# Altium project democritus-robot.PrjPcb
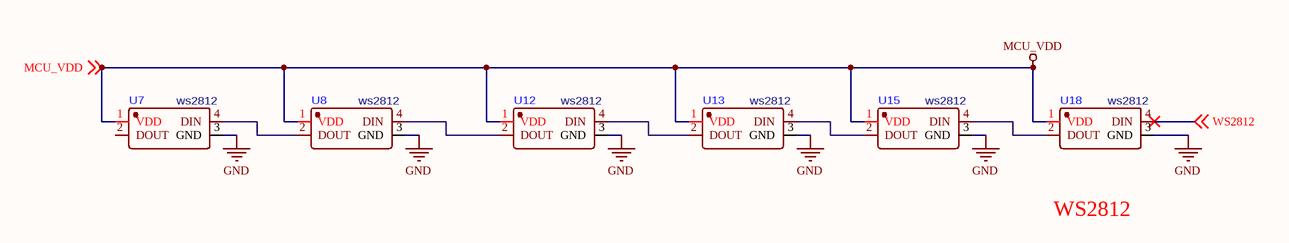
[diagram p0: 06_WS2812.SchDoc]
6 sheets, 177 parts. Net scope: global (net labels, ports and power ports of the same name join across sheets).
Board file: V1.PcbDoc
Sheets:
  06_WS2812.SchDoc
  05_interface.SchDoc
  04_Codec.SchDoc
  03_ADC.SchDoc
  02_Module.SchDoc
  01_Power.SchDoc

## Sheet 06_WS2812.SchDoc
size A4

### Parts
U7  ws2812  [WS2812B(3528)]
U8  ws2812  [WS2812B(3528)]
U12  ws2812  [WS2812B(3528)]
U13  ws2812  [WS2812B(3528)]
U15  ws2812  [WS2812B(3528)]
U18  ws2812  [WS2812B(3528)]

### Nets
GND: U7.3(GND) U8.3(GND) U12.3(GND) U13.3(GND) U15.3(GND) U18.3(GND)
MCU_VDD: U7.1(VDD) U8.1(VDD) U12.1(VDD) U13.1(VDD) U15.1(VDD) U18.1(VDD) ; off-sheet MCU_VDD
WS2812: U18.4(DIN) ; off-sheet WS2812  [project net GPIO38]
NetU7_4: U7.4(DIN) U8.2(DOUT)
NetU8_4: U8.4(DIN) U12.2(DOUT)
NetU12_4: U12.4(DIN) U13.2(DOUT)
NetU13_4: U13.4(DIN) U15.2(DOUT)
NetU15_4: U15.4(DIN) U18.2(DOUT)

Not connected (* = marked no-connect by the designer): U7 2(DOUT)

### Notes on the sheet
- WS2812

### Library data of the parts
U7 U8 U12 U13 U15 U18 = YOTC-WS2812B-3528: ws2812_3528

## Sheet 05_interface.SchDoc
size 513 x 386 mm
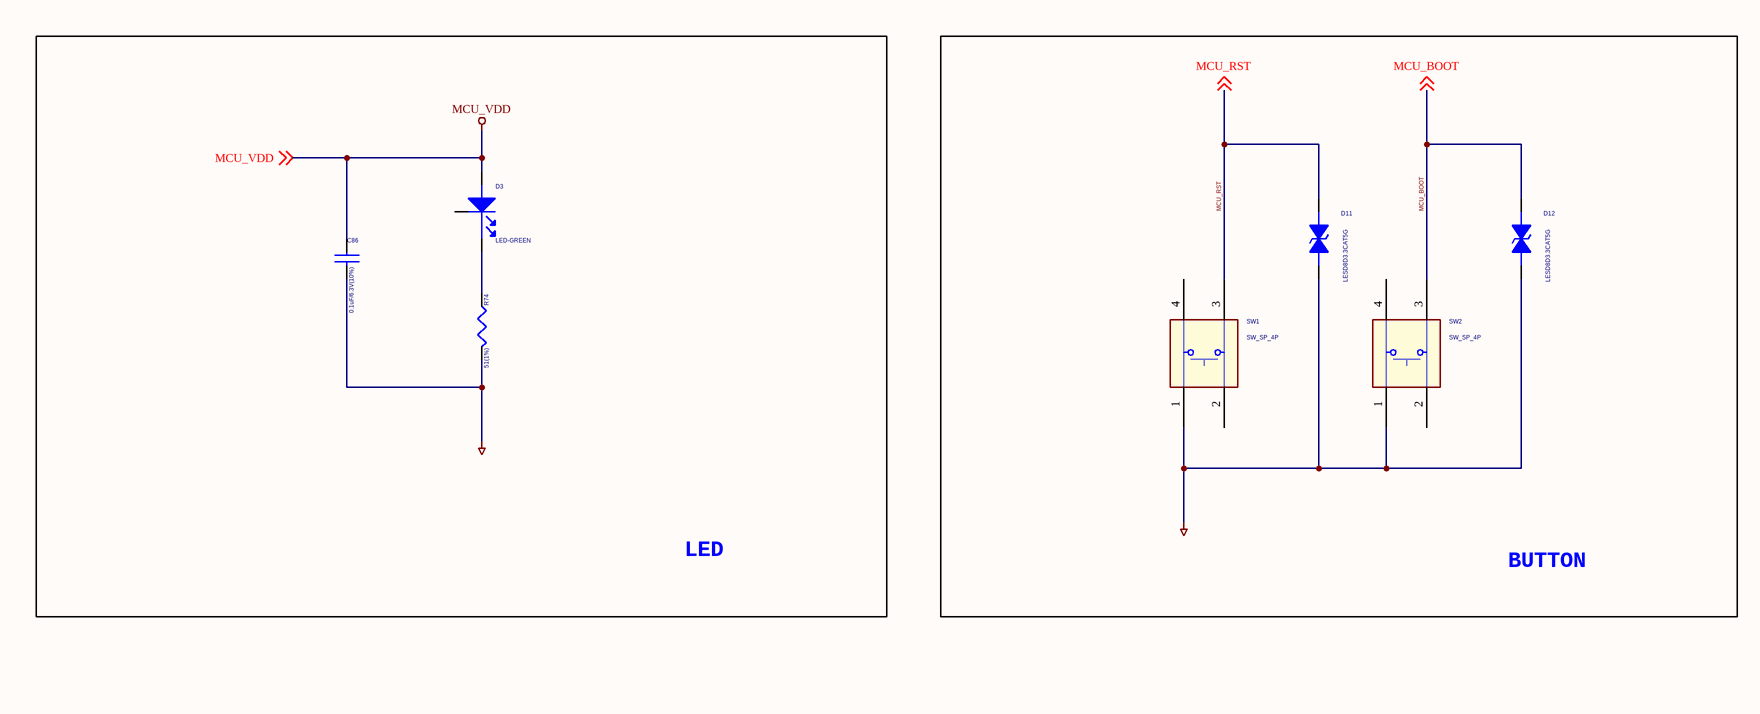
[diagram p1: 05_interface.SchDoc, left]
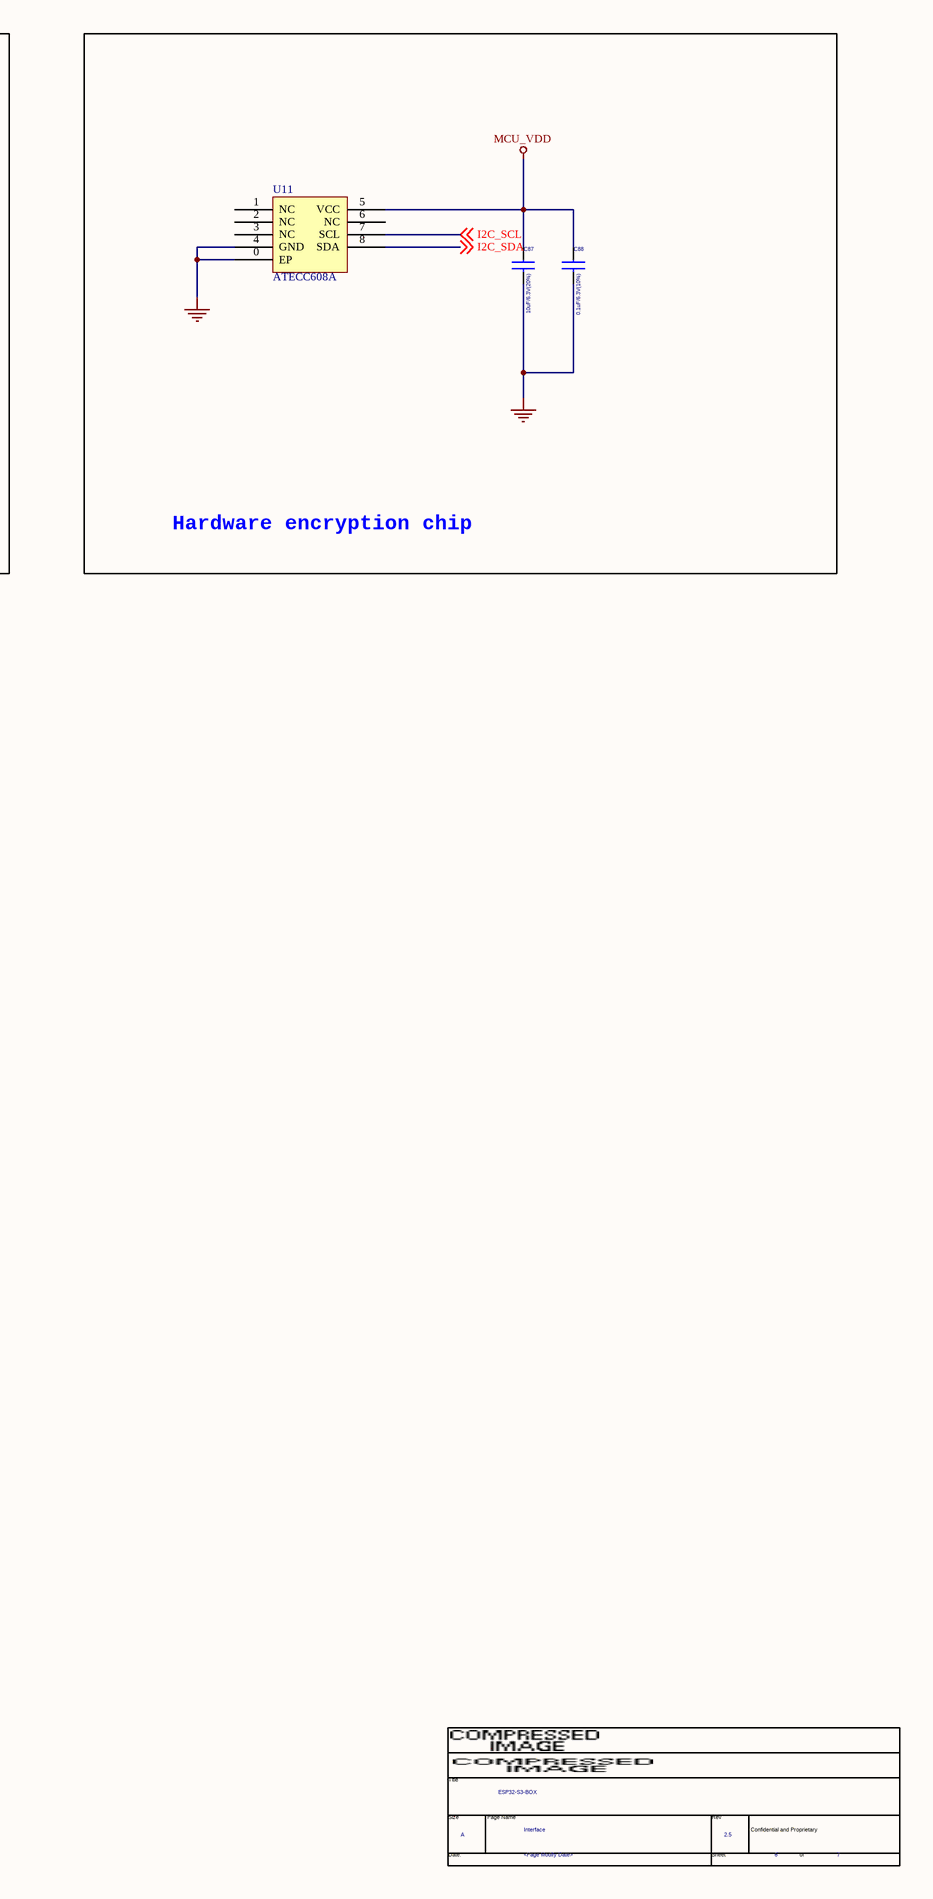
[diagram p2: 05_interface.SchDoc, right]

### Parts
(Parts that share a designator on the sheet are numbered #1, #2 ... from top to bottom, then left to right.)
*#1  Page Modify Date: <Page Modify Date>  Page Name: Interface  Title: ESP32-S3-BOX  Page Size: A  Page Number: 6  Page Count: 7  RevCode: 2.5  (hidden comment: espTitleBlock3)  (graphical)
C86  0.1uF/6.3V(10%)  [0402_C]
C87  10uF/6.3V(20%)  [0402_C]
C88  0.1uF/6.3V(10%)  [0402_C]
D3  LED-GREEN  [0603_L]
D11  LESD8D3.3CAT5G  [SOD-882]
D12  LESD8D3.3CAT5G  [SOD-882]
R74  51(1%)  [0201_R]
SW1  SW_SP_4P  [Key3*4*2.5]
SW2  SW_SP_4P  [Key3*4*2.5]
U11  ATECC608A  [DFN-8_EP_3x3mm]

### Blocks framed on the sheet
LED: C86 D3 R74
BUTTON: D11 D12 SW1 SW2
Hardware encryption chip: C87 C88 U11

### Nets
GND: C86.2 C87.2 C88.2 D11.1 D12.1 R74.2 SW1.1 SW2.1 U11.0(EP) U11.4(GND)
MCU_VDD: C86.1 C87.1 C88.1 D3.1 U11.5(VCC) ; off-sheet MCU_VDD
I2C_SCL: U11.7(SCL) ; off-sheet I2C_SCL  [project net GPIO18]
I2C_SDA: U11.8(SDA) ; off-sheet I2C_SDA  [project net GPIO8]
MCU_BOOT: D12.2 SW2.3 ; off-sheet MCU_BOOT  [project net GPIO0]
MCU_RST: D11.2 SW1.3 ; off-sheet MCU_RST
NetD3_2: D3.2 R74.1

Not connected (* = marked no-connect by the designer): D3 3; SW1 2 4; SW2 2 4; U11 1(NC) 2(NC) 3(NC) 6(NC)

### Notes on the sheet
- (in symbol espTitleBlock3) Title; Size; Page Name; Rev; Confidential and Proprietary; Date:; Sheet; of

### Library data of the parts
*#1 = espTitleBlock3: Doc: ESP32-S3-EYE_V1.0; OrgName: ESPRESSIF
C86 C88 = CAPACITOR: Part Number: ES11045102620001; CODE12: ES11.04.510.2.6.2.00; Part Type: Capacitor
C87 = CAPACITOR: Part Number: ES11047102710000; CODE12: ES11.04.710.2.7.1.00; Part Type: Capacitor
D11 D12 = DIODE_BI_DIR: Part Number: ES31320010000000; CODE12: ES31.32.0010.00.0.0; Part Type: Diode
R74 = RESISTOR: Part Number: ES21021510000001; CODE12: ES21.02.1510.0.00.0; Part Type: Resistor
SW1 SW2 = SW_SP_4P: CLASS: DISCRETE; TIME: 2004-11-29

## Sheet 04_Codec.SchDoc
size 513 x 386 mm
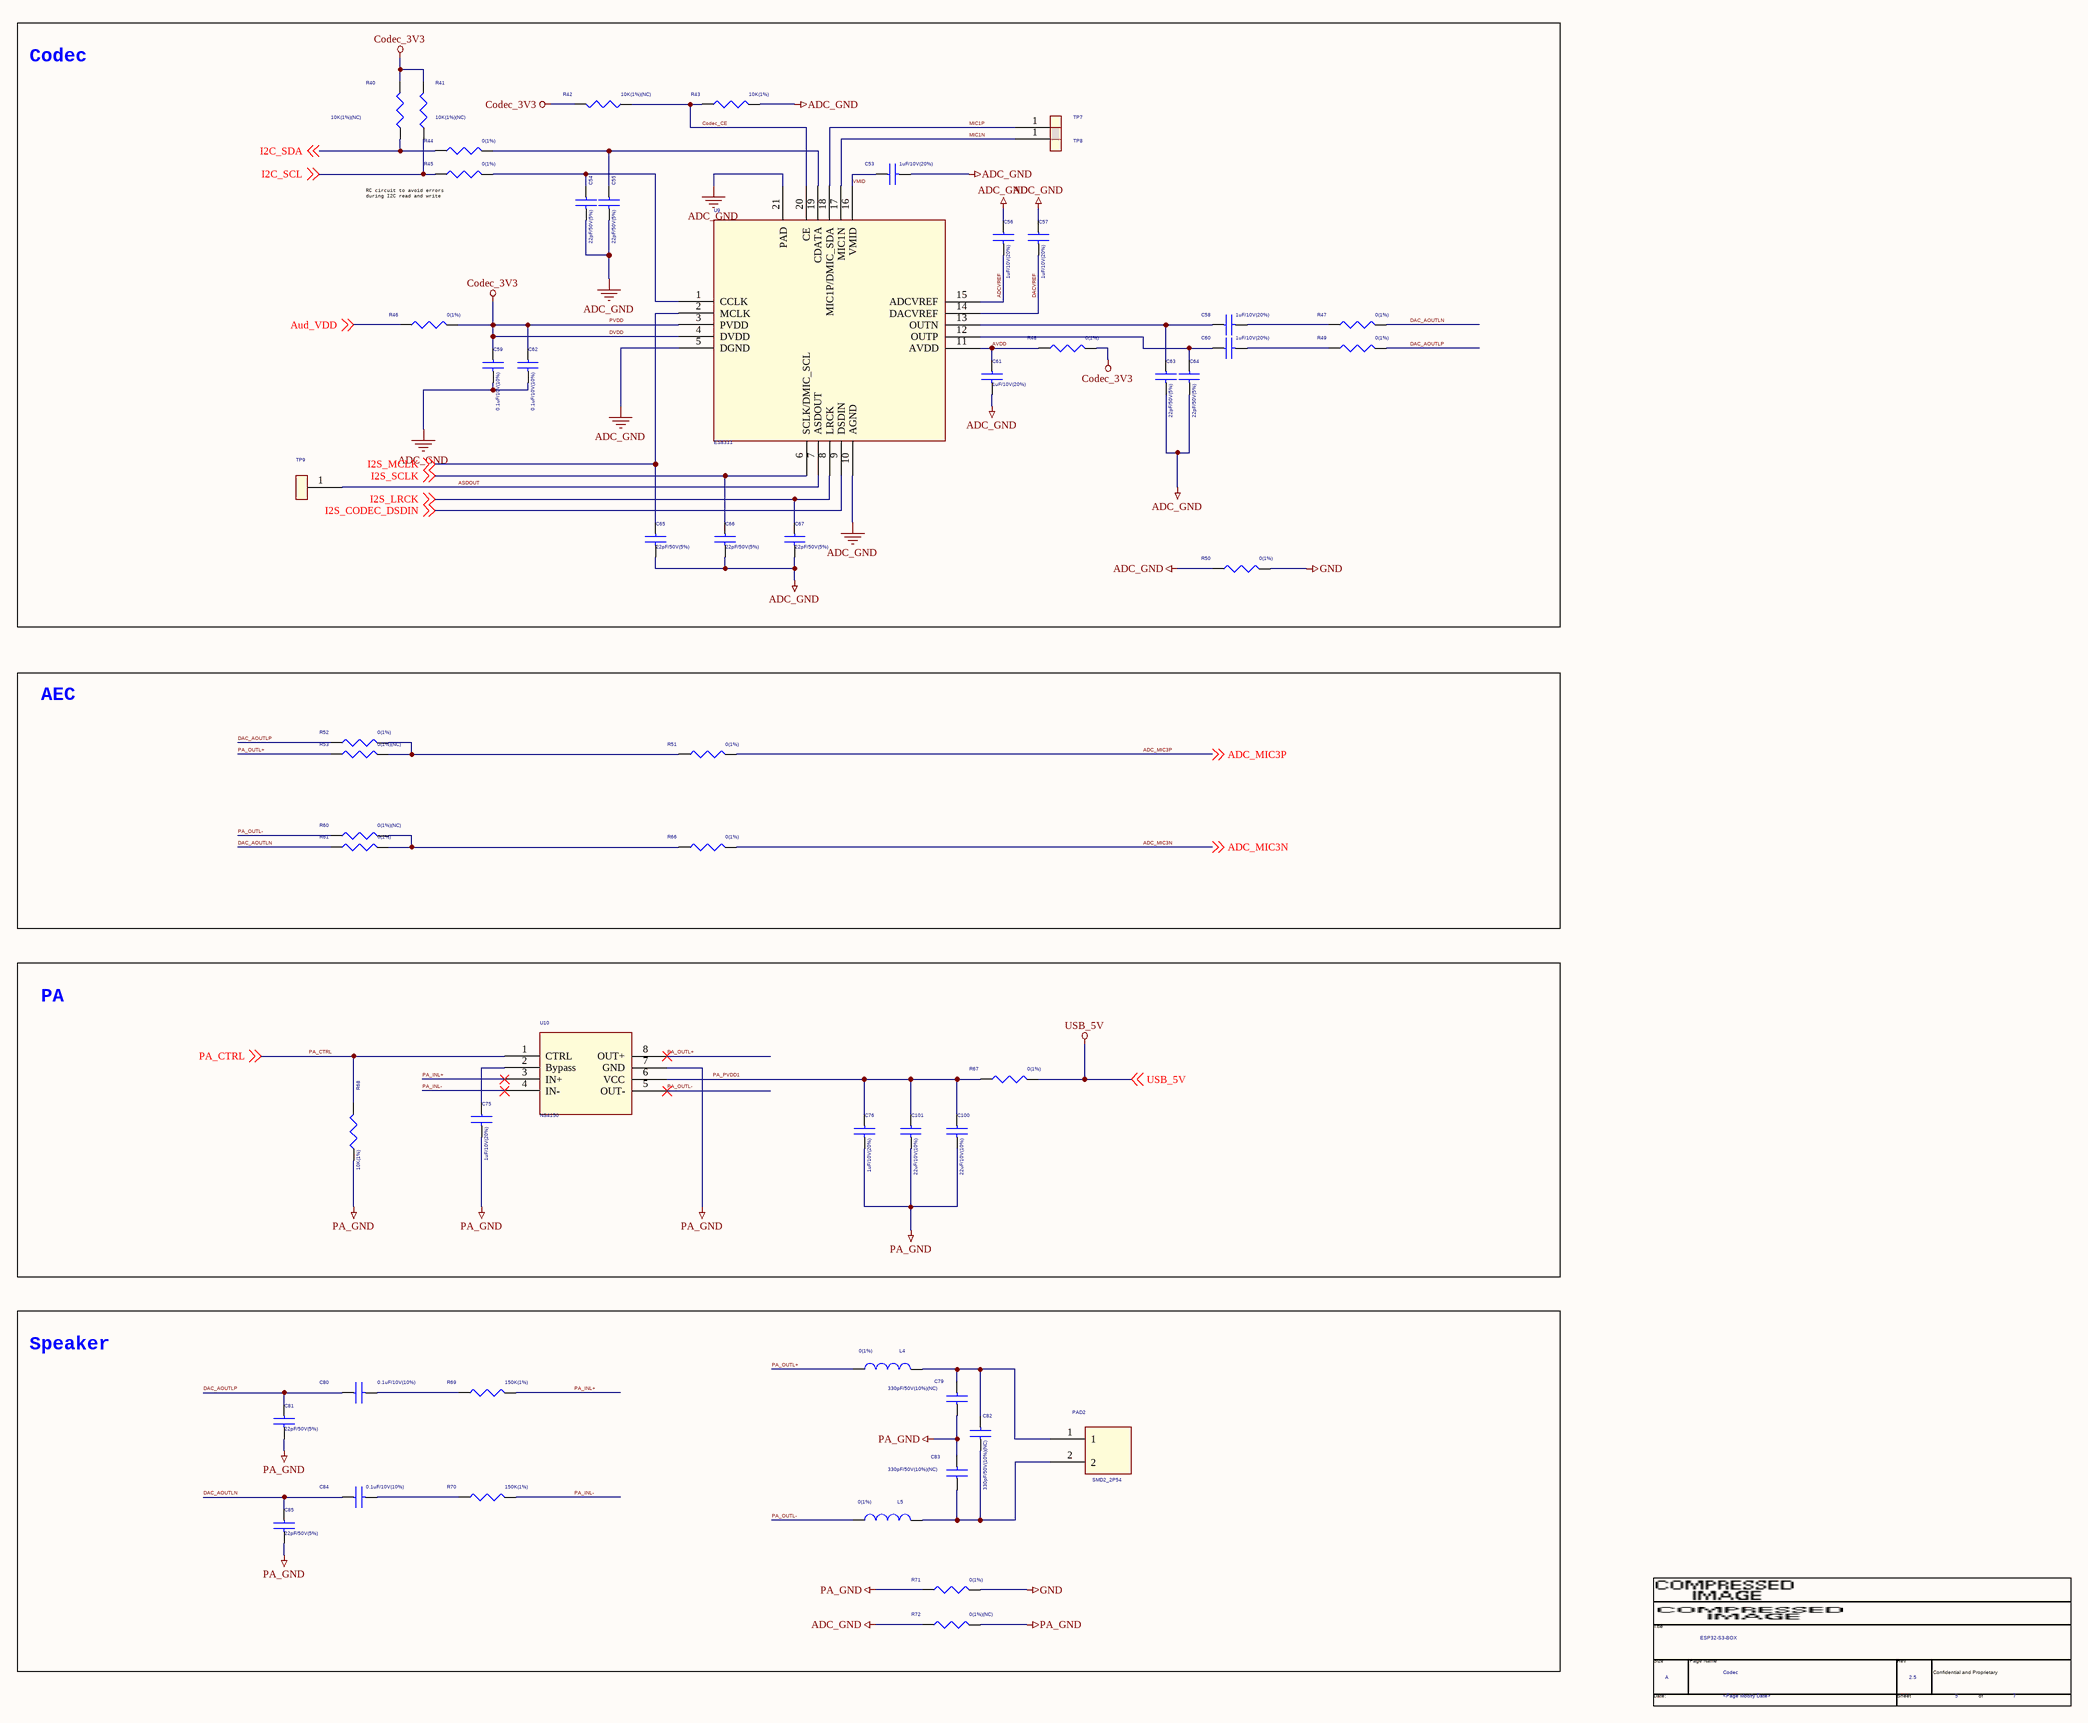
[diagram p3: 04_Codec.SchDoc]

### Parts
(Parts that share a designator on the sheet are numbered #1, #2 ... from top to bottom, then left to right.)
*#2  Page Modify Date: <Page Modify Date>  Page Name: Codec  Title: ESP32-S3-BOX  Page Size: A  Page Number: 5  Page Count: 7  RevCode: 2.5  (hidden comment: espTitleBlock3)  (graphical)
C53  1uF/10V(20%)  [0201_C]
C54  22pF/50V(5%)  [0201_C]
C55  22pF/50V(5%)  [0201_C]
C56  1uF/10V(20%)  [0201_C]
C57  1uF/10V(20%)  [0201_C]
C58  1uF/10V(20%)  [0201_C]
C59  0.1uF/10V(10%)  [0201_C]
C60  1uF/10V(20%)  [0201_C]
C61  1uF/10V(20%)  [0201_C]
C62  0.1uF/10V(10%)  [0201_C]
C63  22pF/50V(5%)  [0201_C]
C64  22pF/50V(5%)  [0201_C]
C65  22pF/50V(5%)  [0201_C]
C66  22pF/50V(5%)  [0201_C]
C67  22pF/50V(5%)  [0201_C]
C75  1uF/10V(20%)  [0201_C]
C76  1uF/10V(20%)  [0201_C]
C79  330pF/50V(10%)(NC)  [0201_C]
C80  0.1uF/10V(10%)  [0201_C]
C81  22pF/50V(5%)  [0201_C]
C82  330pF/50V(10%)(NC)  [0201_C]
C83  330pF/50V(10%)(NC)  [0201_C]
C84  0.1uF/10V(10%)  [0201_C]
C85  22pF/50V(5%)  [0201_C]
C100  22uF/10V(10%)  [0805_C]
C101  22uF/10V(10%)  [0805_C]
L4  0(1%)  [0603_R]
L5  0(1%)  [0603_R]
PAD2  SMD2_2P54  [2pin]
R40  10K(1%)(NC)  [0201_R]
R41  10K(1%)(NC)  [0201_R]
R42  10K(1%)(NC)  [0201_R]
R43  10K(1%)  [0201_R]
R44  0(1%)  [0201_R]
R45  0(1%)  [0201_R]
R46  0(1%)  [0402_R]
R47  0(1%)  [0201_R]
R48  0(1%)  [0402_R]
R49  0(1%)  [0201_R]
R50  0(1%)  [0402_R]
R51  0(1%)  [0201_R]
R52  0(1%)  [0201_R]
R53  0(1%)(NC)  [0201_R]
R60  0(1%)(NC)  [0201_R]
R61  0(1%)  [0201_R]
R66  0(1%)  [0201_R]
R67  0(1%)  [0402_R]
R68  10K(1%)  [0201_R]
R69  150K(1%)  [0402_R]
R70  150K(1%)  [0402_R]
R71  0(1%)  [0402_R]
R72  0(1%)(NC)  [0402_R]
TP7  TESTPOINT  [TPC_D40]  (value not drawn)
TP8  TESTPOINT  [TPC_D40]  (value not drawn)
TP9  TESTPOINT  [TPC_D40]  (value not drawn)
U9  ES8311  [QFN-20_4X4]
U10  NS4150  [MSOP-8]

### Blocks framed on the sheet
Codec: C53-C67 R40-R50 TP7-TP9 U9
AEC: R51-R53 R60 R61 R66
PA: C75 C76 C100 C101 R67 R68 U10
Speaker: C79-C85 L4 L5 PAD2 R69-R72

### Nets
ADC_GND: C53.2 C54.2 C55.2 C56.1 C57.1 C59.2 C61.2 C62.2 C63.2 C64.2 C65.2 C66.2 C67.2 R43.2 R50.1 R72.1 U9.5(DGND) U9.10(AGND) U9.21(PAD)
Aud_VDD: R46.1 ; off-sheet Aud_VDD
DVDD: C59.1 C62.1 R40.2 R41.2 R42.2 R46.2 R48.2 U9.3(PVDD) U9.4(DVDD)  [also labelled Codec_3V3, PVDD]
GND: R50.2 R71.2
PA_GND: C75.2 C76.2 C79.1 C81.2 C83.2 C85.2 C100.2 C101.2 R68.1 R71.1 R72.2 U10.7(GND)
USB_5V: R67.2 ; off-sheet USB_5V
ADC_MIC3N: R66.2 ; off-sheet ADC_MIC3N
ADC_MIC3P: R51.2 ; off-sheet ADC_MIC3P
ADCVREF: C56.2 U9.15(ADCVREF)
ASDOUT: TP9.1 U9.7(ASDOUT)
AVDD: C61.1 R48.1 U9.11(AVDD)
Codec_CE: R42.1 R43.1 U9.20(CE)
DAC_AOUTLN: C84.1 C85.1 R47.2 R61.1
DAC_AOUTLP: C80.1 C81.1 R49.2 R52.1
DACVREF: C57.2 U9.14(DACVREF)
I2C_SCL: R41.1 R45.1 ; off-sheet I2C_SCL  [project net GPIO18]
I2C_SDA: R40.1 R44.1 ; off-sheet I2C_SDA  [project net GPIO8]
I2S_CODEC_DSDIN: U9.9(DSDIN) ; off-sheet I2S_CODEC_DSDIN  [project net GPIO15]
I2S_LRCK: C67.1 U9.8(LRCK) ; off-sheet I2S_LRCK  [project net GPIO47]
I2S_MCLK: C65.1 U9.2(MCLK) ; off-sheet I2S_MCLK  [project net GPIO2]
I2S_SCLK: C66.1 U9.6(SCLK/DMIC_SCL) ; off-sheet I2S_SCLK  [project net GPIO17]
MIC1N: TP8.1 U9.17(MIC1N)
MIC1P: TP7.1 U9.18(MIC1P/DMIC_SDA)
PA_CTRL: R68.2 U10.1(CTRL) ; off-sheet PA_CTRL  [project net GPIO46]
PA_INL+: R69.2 U10.3(IN+)
PA_INL-: R70.2 U10.4(IN-)
PA_OUTL+: L4.2 R53.1 U10.8(OUT+)
PA_OUTL-: L5.2 R60.1 U10.5(OUT-)
PA_PVDD1: C76.1 C100.1 C101.1 R67.1 U10.6(VCC)
VMID: C53.1 U9.16(VMID)
NetC54_1: C54.1 R45.2 U9.1(CCLK)
NetC55_1: C55.1 R44.2 U9.19(CDATA)
NetC58_1: C58.1 C63.1 U9.13(OUTN)
NetC58_2: C58.2 R47.1
NetC60_1: C60.1 C64.1 U9.12(OUTP)
NetC60_2: C60.2 R49.1
NetC75_1: C75.1 U10.2(Bypass)
NetC79_2: C79.2 C82.2 L4.1 PAD2.1
NetC80_2: C80.2 R69.1
NetC82_1: C82.1 C83.1 L5.1 PAD2.2
NetC84_2: C84.2 R70.1
NetR51_1: R51.1 R52.2 R53.2
NetR60_2: R60.2 R61.2 R66.1

### Notes on the sheet
- (near R45) RC circuit to avoid errors
  during I2C read and write
- (in symbol espTitleBlock3) Title; Size; Page Name; Rev; Confidential and Proprietary; Date:; Sheet; of

### Library data of the parts
*#2 = espTitleBlock3: as *#1 on sheet 05_interface
C53 C56-C58 C60 C61 C75 C76 = CAPACITOR: Part Number: ES11026103700001; CODE12: ES11.02.610.3.7.0.00; Part Type: Capacitor
C54 C55 C63-C67 C81 C85 = CAPACITOR: Part Number: ES11021226520000; CODE12: ES11.02.122.6.5.2.00; Part Type: Capacitor
C59 C62 C80 C84 = CAPACITOR: Part Number: ES11025103610001; CODE12: ES11.02.510.3.6.1.00; Part Type: Capacitor
C79 C82 C83 = CAP NP
C100 C101 = CAPACITOR: Part Number: ES11087223720000; CODE12: ES11.08.722.3.7.2.00; Part Type: Capacitor
L4 L5 = INDUCTOR
R40-R43 R68 = RESISTOR: Part Number: ES21024100000001; CODE12: ES21.02.4100.0.00.0; Part Type: Resistor
R44 R45 R47 R49 R51-R53 R60 R61 R66 = RESISTOR: Part Number: ES21020000000001; CODE12: ES21.02.0000.0.00.0; Part Type: Resistor
R46 R48 R50 R67 R71 R72 = RESISTOR: Part Number: ES21040000000001; CODE12: ES21.04.0000.0.00.0; Part Type: Resistor
R69 R70 = RESISTOR: Part Number: ES21045150000001; CODE12: ES21.04.5150.0.00.0; Part Type: Resistor
TP7-TP9 = TESTPOINT: Part Number: ES51990010000000; CODE12: ES51.99.0010.00.00; Part Type: -
U9 = ES8311: Part Number: ES41181204000000; CODE12: ES41.18.12.04.00.00; Part Type: Audio ICs
U10 = NS4150: Part Number: ES41180401000000; CODE12: ES41.18.04.01.00.00; Part Type: Audio ICs

## Sheet 03_ADC.SchDoc
size 513 x 386 mm
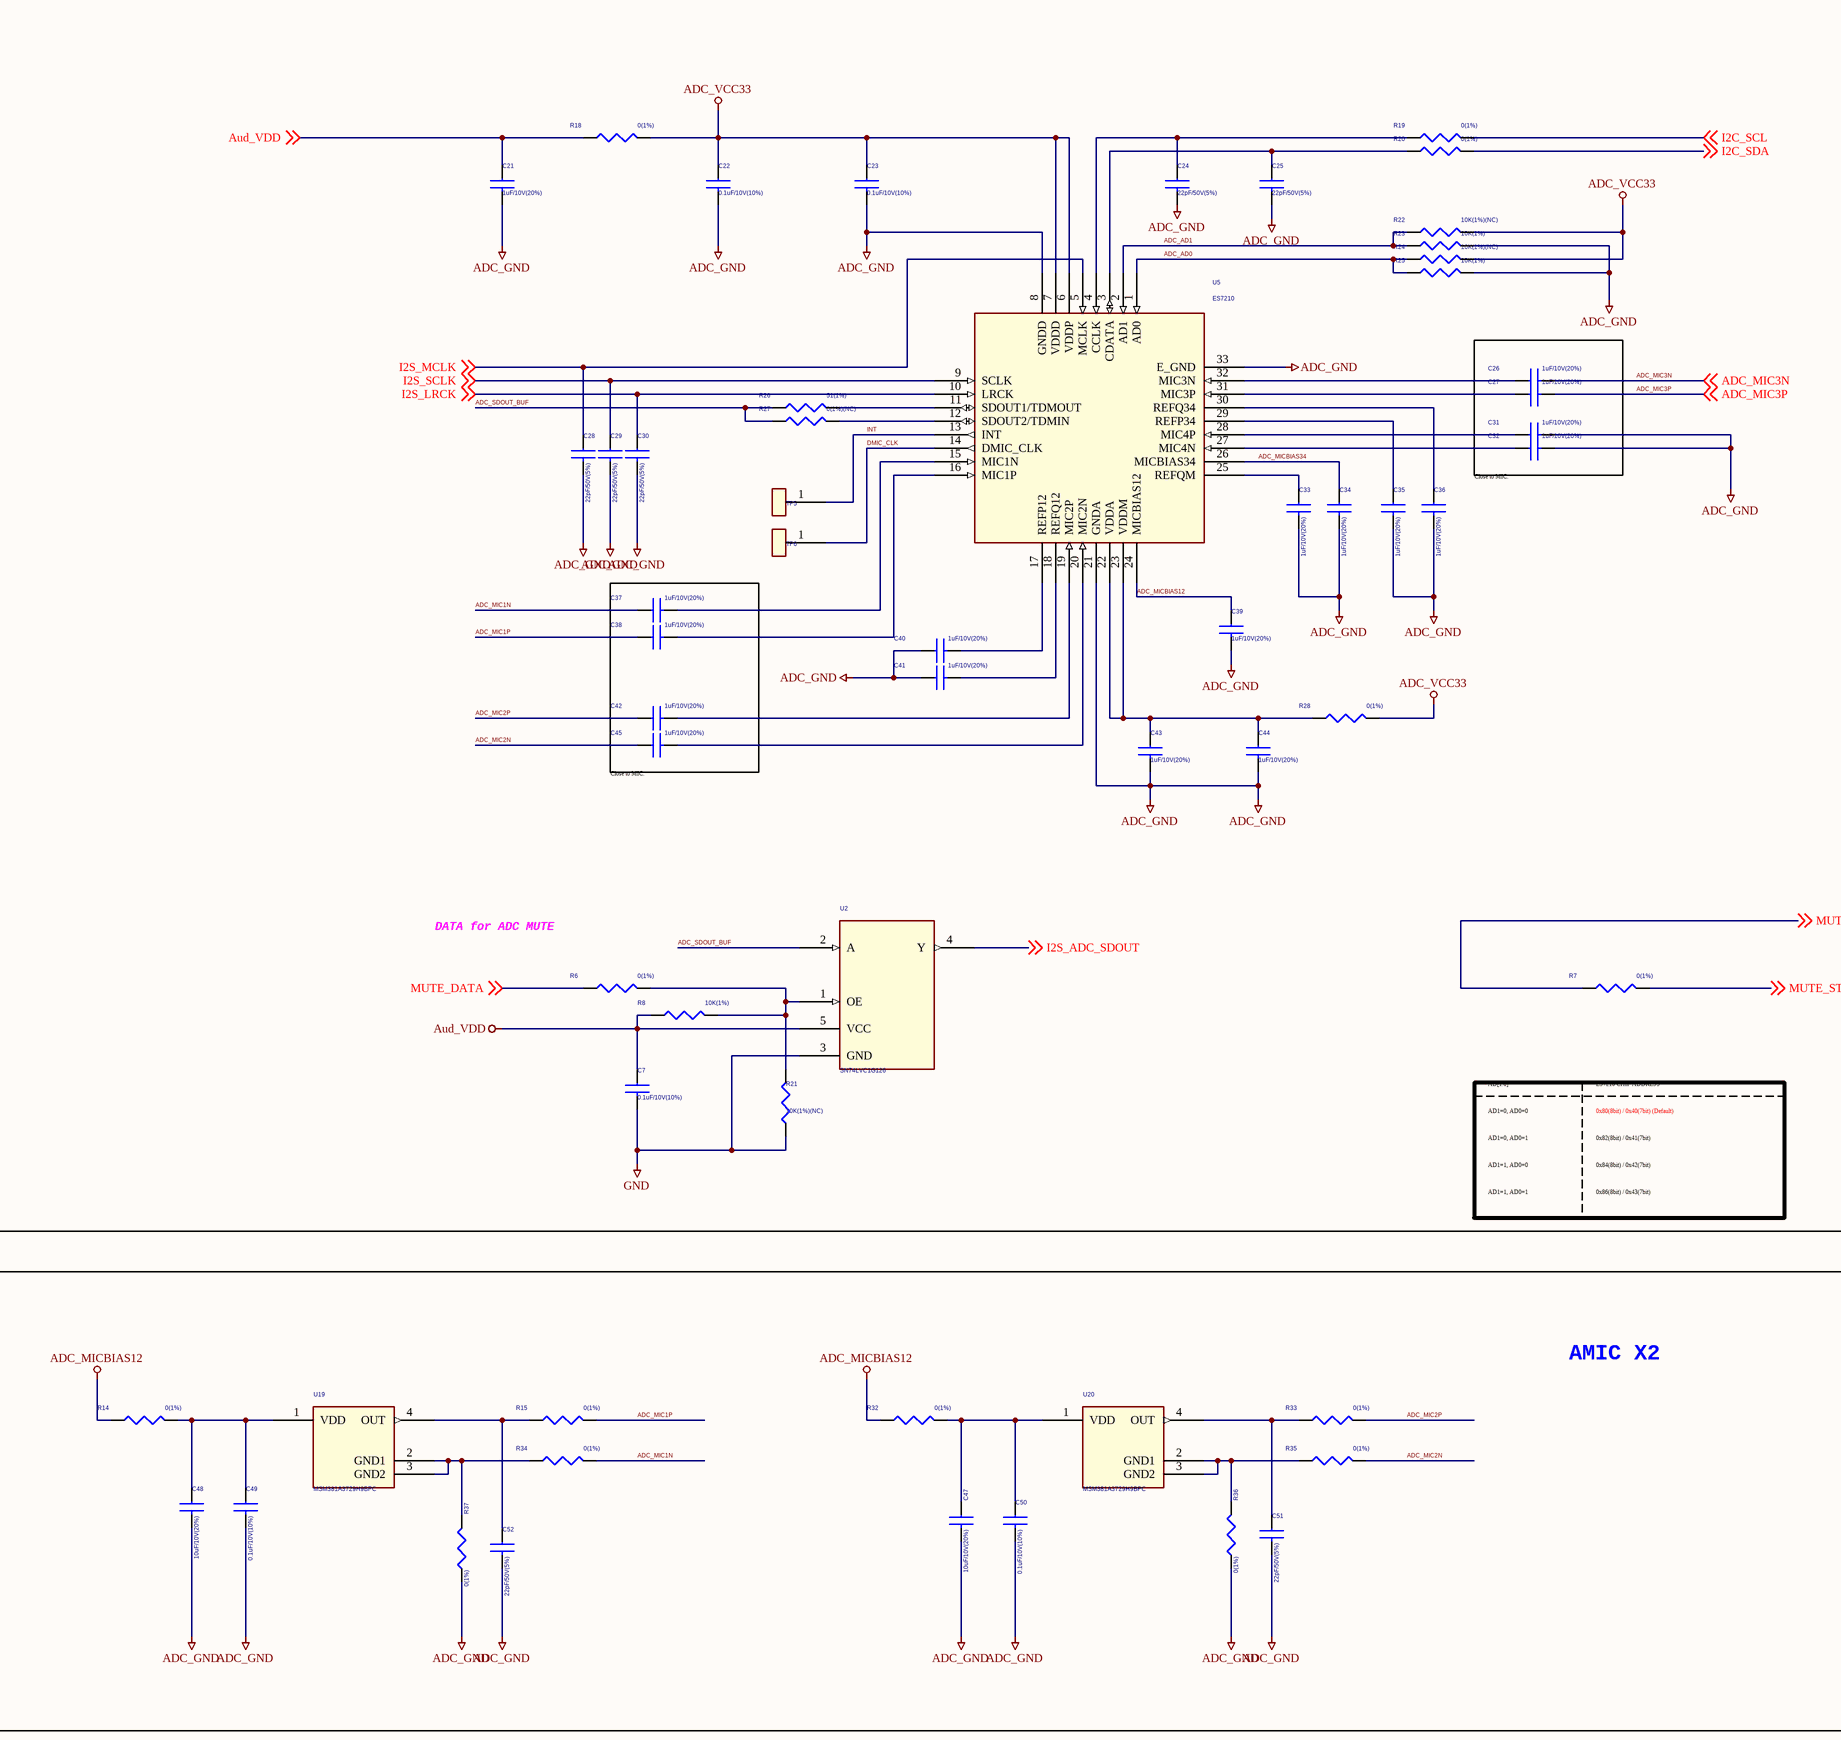
[diagram p4: 03_ADC.SchDoc, left]
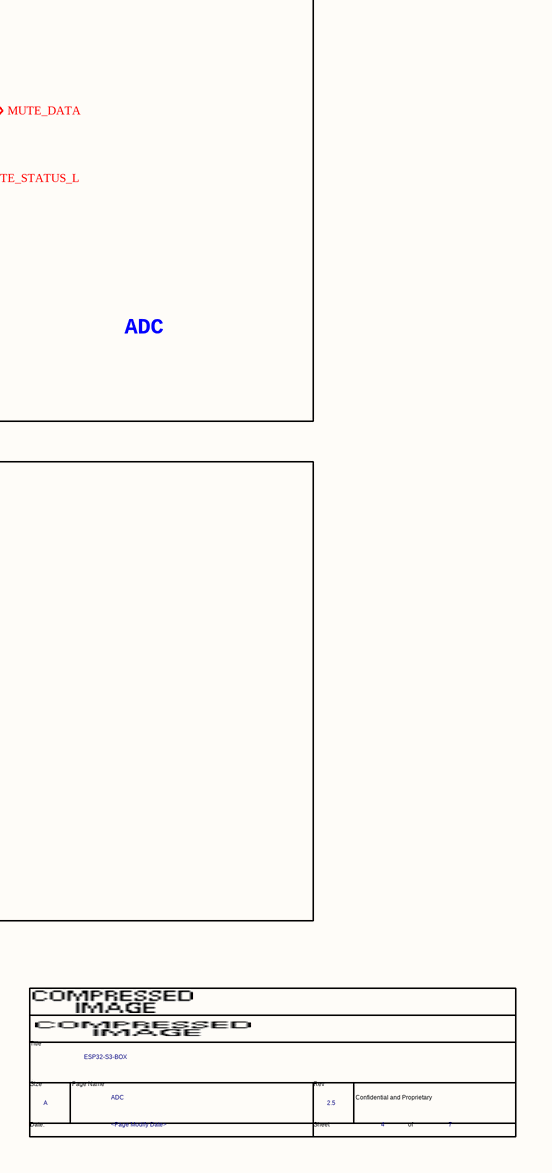
[diagram p5: 03_ADC.SchDoc, right]

### Parts
(Parts that share a designator on the sheet are numbered #1, #2 ... from top to bottom, then left to right.)
*#3  Page Modify Date: <Page Modify Date>  Page Name: ADC  Title: ESP32-S3-BOX  Page Size: A  Page Number: 4  Page Count: 7  RevCode: 2.5  (hidden comment: espTitleBlock3)  (graphical)
C7  0.1uF/10V(10%)  [0201_C]
C21  1uF/10V(20%)  [0201_C]
C22  0.1uF/10V(10%)  [0201_C]
C23  0.1uF/10V(10%)  [0201_C]
C24  22pF/50V(5%)  [0201_C]
C25  22pF/50V(5%)  [0201_C]
C26  1uF/10V(20%)  [0201_C]
C27  1uF/10V(20%)  [0201_C]
C28  22pF/50V(5%)  [0201_C]
C29  22pF/50V(5%)  [0201_C]
C30  22pF/50V(5%)  [0201_C]
C31  1uF/10V(20%)  [0201_C]
C32  1uF/10V(20%)  [0201_C]
C33  1uF/10V(20%)  [0201_C]
C34  1uF/10V(20%)  [0201_C]
C35  1uF/10V(20%)  [0201_C]
C36  1uF/10V(20%)  [0201_C]
C37  1uF/10V(20%)  [0201_C]
C38  1uF/10V(20%)  [0201_C]
C39  1uF/10V(20%)  [0201_C]
C40  1uF/10V(20%)  [0201_C]
C41  1uF/10V(20%)  [0201_C]
C42  1uF/10V(20%)  [0201_C]
C43  1uF/10V(20%)  [0201_C]
C44  1uF/10V(20%)  [0201_C]
C45  1uF/10V(20%)  [0201_C]
C47  10uF/10V(20%)  [0402_C]
C48  10uF/10V(20%)  [0402_C]
C49  0.1uF/10V(10%)  [0201_C]
C50  0.1uF/10V(10%)  [0201_C]
C51  22pF/50V(5%)  [0201_C]
C52  22pF/50V(5%)  [0201_C]
R6  0(1%)  [0201_R]
R7  0(1%)  [0402_R]
R8  10K(1%)  [0201_R]
R14  0(1%)  [0402_R]
R15  0(1%)  [0201_R]
R18  0(1%)  [0402_R]
R19  0(1%)  [0201_R]
R20  0(1%)  [0201_R]
R21  10K(1%)(NC)  [0201_R]
R22  10K(1%)(NC)  [0201_R]
R23  10K(1%)  [0201_R]
R24  10K(1%)(NC)  [0201_R]
R25  10K(1%)  [0201_R]
R26  51(1%)  [0201_R]
R27  0(1%)(NC)  [0201_R]
R28  0(1%)  [0402_R]
R32  0(1%)  [0402_R]
R33  0(1%)  [0201_R]
R34  0(1%)  [0201_R]
R35  0(1%)  [0201_R]
R36  0(1%)  [0201_R]
R37  0(1%)  [0201_R]
TP5  TESTPOINT  [TPC_D40]  (value not drawn)
TP6  TESTPOINT  [TPC_D40]  (value not drawn)
U2  SN74LVC1G126  [SC-70-5]
U5  ES7210  [QFN-32_5x5x05P]
U19  MSM381A3729H9BPC  [MSM381]
U20  MSM381A3729H9BPC  [MSM381]

### Blocks framed on the sheet
ADC: C7 C21-C45 R6-R8 R18-R28 TP5 TP6 U2 U5
AMIC X2: C47-C52 R14 R15 R32-R37 U19 U20

### Nets
ADC_GND: C21.2 C22.2 C23.2 C24.2 C25.2 C28.2 C29.2 C30.2 C31.2 C32.2 C33.2 C34.2 C35.2 C36.2 C39.2 C40.1 C41.1 C43.2 C44.2 C47.2 C48.2 C49.2 C50.2 C51.2 C52.2 R23.2 R25.2 R36.1 R37.1 U5.8(GNDD) U5.21(GNDA) U5.33(E_GND)
ADC_MICBIAS12: C39.1 R14.1 R32.1 U5.24(MICBIAS12)
ADC_VCC33: C22.1 C23.1 R18.2 R22.2 R24.2 R28.2 U5.6(VDDP) U5.7(VDDD)
Aud_VDD: C7.1 C21.1 R8.1 R18.1 U2.5(VCC) ; off-sheet Aud_VDD
GND: C7.2 R21.1 U2.3(GND)
ADC_AD0: R24.1 R25.1 U5.1(AD0)
ADC_AD1: R22.1 R23.1 U5.2(AD1)
ADC_MIC1N: C37.1 R34.2
ADC_MIC1P: C38.1 R15.2
ADC_MIC2N: C45.1 R35.2
ADC_MIC2P: C42.1 R33.2
ADC_MIC3N: C26.2 ; off-sheet ADC_MIC3N
ADC_MIC3P: C27.2 ; off-sheet ADC_MIC3P
ADC_MICBIAS34: C34.1 U5.26(MICBIAS34)
ADC_SDOUT_BUF: R26.1 R27.1 U2.2(A)
DMIC_CLK: TP6.1 U5.14(DMIC_CLK)
I2C_SCL: R19.2 ; off-sheet I2C_SCL  [project net GPIO18]
I2C_SDA: R20.2 ; off-sheet I2C_SDA  [project net GPIO8]
I2S_ADC_SDOUT: U2.4(Y) ; off-sheet I2S_ADC_SDOUT  [project net GPIO16]
I2S_LRCK: C30.1 U5.10(LRCK) ; off-sheet I2S_LRCK  [project net GPIO47]
I2S_MCLK: C28.1 U5.5(MCLK) ; off-sheet I2S_MCLK  [project net GPIO2]
I2S_SCLK: C29.1 U5.9(SCLK) ; off-sheet I2S_SCLK  [project net GPIO17]
INT: TP5.1 U5.13(INT)
MUTE_DATA: R6.1 R7.1 ; off-sheet MUTE_DATA
MUTE_STATUS_L: R7.2 ; off-sheet MUTE_STATUS_L  [project net GPIO1]
NetC24_1: C24.1 R19.1 U5.4(CCLK)
NetC25_1: C25.1 R20.1 U5.3(CDATA)
NetC26_1: C26.1 U5.32(MIC3N)
NetC27_1: C27.1 U5.31(MIC3P)
NetC31_1: C31.1 U5.28(MIC4P)
NetC32_1: C32.1 U5.27(MIC4N)
NetC33_1: C33.1 U5.25(REFQM)
NetC35_1: C35.1 U5.29(REFP34)
NetC36_1: C36.1 U5.30(REFQ34)
NetC37_2: C37.2 U5.15(MIC1N)
NetC38_2: C38.2 U5.16(MIC1P)
NetC40_2: C40.2 U5.17(REFP12)
NetC41_2: C41.2 U5.18(REFQ12)
NetC42_2: C42.2 U5.19(MIC2P)
NetC43_1: C43.1 C44.1 R28.1 U5.22(VDDA) U5.23(VDDM)
NetC45_2: C45.2 U5.20(MIC2N)
NetC47_1: C47.1 C50.1 R32.2 U20.1(VDD)
NetC48_1: C48.1 C49.1 R14.2 U19.1(VDD)
NetC51_1: C51.1 R33.1 U20.4(OUT)
NetC52_1: C52.1 R15.1 U19.4(OUT)
NetR6_2: R6.2 R8.2 R21.2 U2.1(OE)
NetR26_2: R26.2 U5.11(SDOUT1/TDMOUT)
NetR27_2: R27.2 U5.12(SDOUT2/TDMIN)
NetR34_1: R34.1 R37.2 U19.2(GND1) U19.3(GND2)
NetR35_1: R35.1 R36.2 U20.2(GND1) U20.3(GND2)

### Notes on the sheet
- Close to MIC.
- (near C45) Close to MIC.
- DATA for ADC MUTE
- AD[1:0]
- ES7210 CHIP ADDRESS
- AD1=0, AD0=0
- AD1=0, AD0=1
- AD1=1, AD0=0
- 0x80(8bit) / 0x40(7bit) (Default)
- 0x82(8bit) / 0x41(7bit)
- 0x84(8bit) / 0x42(7bit)
- AD1=1, AD0=1
- 0x86(8bit) / 0x43(7bit)
- (in symbol espTitleBlock3) Title; Size; Page Name; Rev; Confidential and Proprietary; Date:; Sheet; of

### Library data of the parts
*#3 = espTitleBlock3: as *#1 on sheet 05_interface
C7 C22 C23 C49 C50 = CAPACITOR: as C59 on sheet 04_Codec; Part Type: Capacitor
C21 C26 C27 C31-C45 = CAPACITOR: as C53 on sheet 04_Codec; Part Type: Capacitor
C24 C25 C28-C30 C51 C52 = CAPACITOR: as C54 on sheet 04_Codec; Part Type: Capacitor
C47 C48 = CAPACITOR: Part Number: ES11047103700000; CODE12: ES11.04.710.3.7.0.00; Part Type: Capacitor
R6 R15 R19 R20 R27 R33-R37 = RESISTOR: as R44 on sheet 04_Codec; Part Type: Resistor
R7 R14 R18 R28 R32 = RESISTOR: as R46 on sheet 04_Codec; Part Type: Resistor
R8 R21-R25 = RESISTOR: as R40 on sheet 04_Codec; Part Type: Resistor
R26 = RESISTOR: as R74 on sheet 05_interface; Part Type: Resistor
TP5 TP6 = TESTPOINT: as TP7 on sheet 04_Codec; Part Type: -
U5 = ES7210: Part Number: ES41181401000000; CODE12: ES41.18.14.01.00.00; Part Type: Audio ICs
U19 U20 = MSM381A3729H9BPC: Part Number: ES41180800000000; CODE12: ES41.18.08.00.00.00; Part Type: MICs

## Sheet 02_Module.SchDoc
size 297 x 209 mm
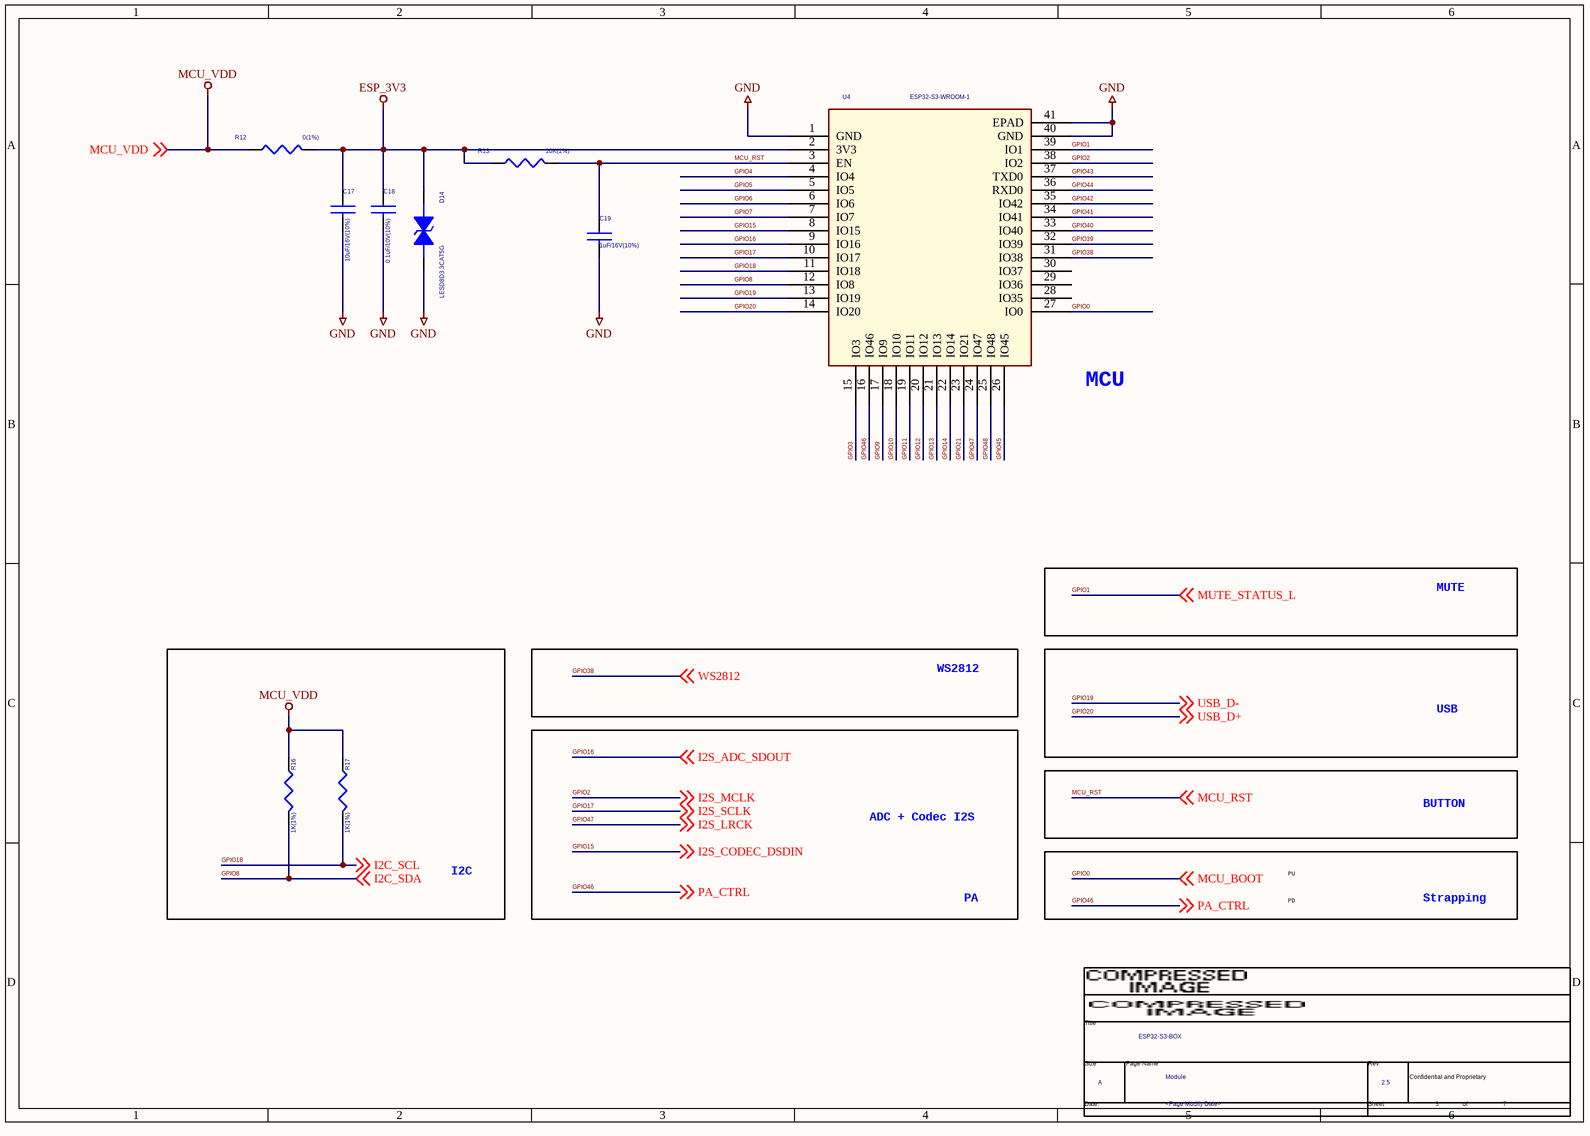
[diagram p6: 02_Module.SchDoc]

### Parts
(Parts that share a designator on the sheet are numbered #1, #2 ... from top to bottom, then left to right.)
*#4  Page Modify Date: <Page Modify Date>  Page Name: Module  Title: ESP32-S3-BOX  Page Size: A  Page Number: 3  Page Count: 7  RevCode: 2.5  (hidden comment: espTitleBlock3)  (graphical)
C17  10uF/16V(10%)  [0603_C]
C18  0.1uF/10V(10%)  [0402_C]
C19  1uF/16V(10%)  [0402_C]
D14  LESD8D3.3CAT5G  [SOD-882]
R12  0(1%)  [0603_R]
R13  10K(1%)  [0402_R]
R16  1K(1%)  [0201_R]
R17  1K(1%)  [0201_R]
U4  ESP32-S3-WROOM-1  [ESP32-S3-WROOM-1]

### Blocks framed on the sheet
I2C: R16 R17

### Nets
ESP_3V3: C17.1 C18.1 D14.2 R12.2 R13.1 U4.2(3V3)
GND: C17.2 C18.2 C19.2 D14.1 U4.1(GND) U4.40(GND) U4.41(EPAD)
MCU_VDD: R12.1 R16.1 R17.1 ; off-sheet MCU_VDD
GPIO0: U4.27(IO0) ; off-sheet MCU_BOOT  [also labelled MCU_BOOT]
GPIO1: U4.39(IO1) ; off-sheet MUTE_STATUS_L  [also labelled MUTE_STATUS_L]
GPIO2: U4.38(IO2) ; off-sheet I2S_MCLK  [also labelled I2S_MCLK]
GPIO3: U4.15(IO3)
GPIO4: U4.4(IO4)
GPIO5: U4.5(IO5)
GPIO6: U4.6(IO6)
GPIO7: U4.7(IO7)
GPIO8: R16.2 U4.12(IO8) ; off-sheet I2C_SDA  [also labelled I2C_SDA]
GPIO9: U4.17(IO9)
GPIO10: U4.18(IO10)
GPIO11: U4.19(IO11)
GPIO12: U4.20(IO12)
GPIO13: U4.21(IO13)
GPIO14: U4.22(IO14)
GPIO15: U4.8(IO15) ; off-sheet I2S_CODEC_DSDIN  [also labelled I2S_CODEC_DSDIN]
GPIO16: U4.9(IO16) ; off-sheet I2S_ADC_SDOUT  [also labelled I2S_ADC_SDOUT]
GPIO17: U4.10(IO17) ; off-sheet I2S_SCLK  [also labelled I2S_SCLK]
GPIO18: R17.2 U4.11(IO18) ; off-sheet I2C_SCL  [also labelled I2C_SCL]
GPIO19: U4.13(IO19) ; off-sheet USB_D-  [also labelled USB_D-]
GPIO20: U4.14(IO20) ; off-sheet USB_D+  [also labelled USB_D+]
GPIO21: U4.23(IO21)
GPIO38: U4.31(IO38) ; off-sheet WS2812  [also labelled WS2812]
GPIO39: U4.32(IO39)
GPIO40: U4.33(IO40)
GPIO41: U4.34(IO41)
GPIO42: U4.35(IO42)
GPIO43: U4.37(TXD0)
GPIO44: U4.36(RXD0)
GPIO45: U4.26(IO45)
GPIO46: U4.16(IO46) ; off-sheet PA_CTRL  [also labelled PA_CTRL]
GPIO47: U4.24(IO47) ; off-sheet I2S_LRCK  [also labelled I2S_LRCK]
GPIO48: U4.25(IO48)
MCU_RST: C19.1 R13.2 U4.3(EN) ; off-sheet MCU_RST

Not connected (* = marked no-connect by the designer): U4 28(IO35) 29(IO36) 30(IO37)

### Notes on the sheet
- MCU
- MUTE
- WS2812
- USB
- BUTTON
- ADC + Codec I2S
- PU
- PA
- PD
- Strapping
- (in symbol espTitleBlock3) Title; Size; Page Name; Rev; Confidential and Proprietary; Date:; Sheet; of

### Library data of the parts
*#4 = espTitleBlock3: as *#1 on sheet 05_interface
C17 = CAPACITOR: Part Number: ES11067104600000; CODE12: ES11.06.710.4.6.0.00; Part Type: Capacitor
C18 = CAPACITOR: Part Number: ES11045103620000; CODE12: ES11.04.510.3.6.2.00; Part Type: Capacitor
C19 = CAPACITOR: Part Number: ES11046104610000; CODE12: ES11.04.610.4.6.1.00; Part Type: Capacitor
D14 = DIODE_BI_DIR: as D11 on sheet 05_interface; Part Type: Diode
R12 = RESISTOR: Part Number: ES21060000000001; CODE12: ES21.06.0000.0.00.0; Part Type: Resistor
R13 = RESISTOR: Part Number: ES21044100000001; CODE12: ES21.04.4100.0.00.0; Part Type: Resistor
R16 R17 = RESISTOR: Part Number: ES21023100000001; CODE12: ES21.02.3100.0.00.0; Part Type: Resistor
U4 = ESP32-S3-WROOM

## Sheet 01_Power.SchDoc
size 513 x 386 mm
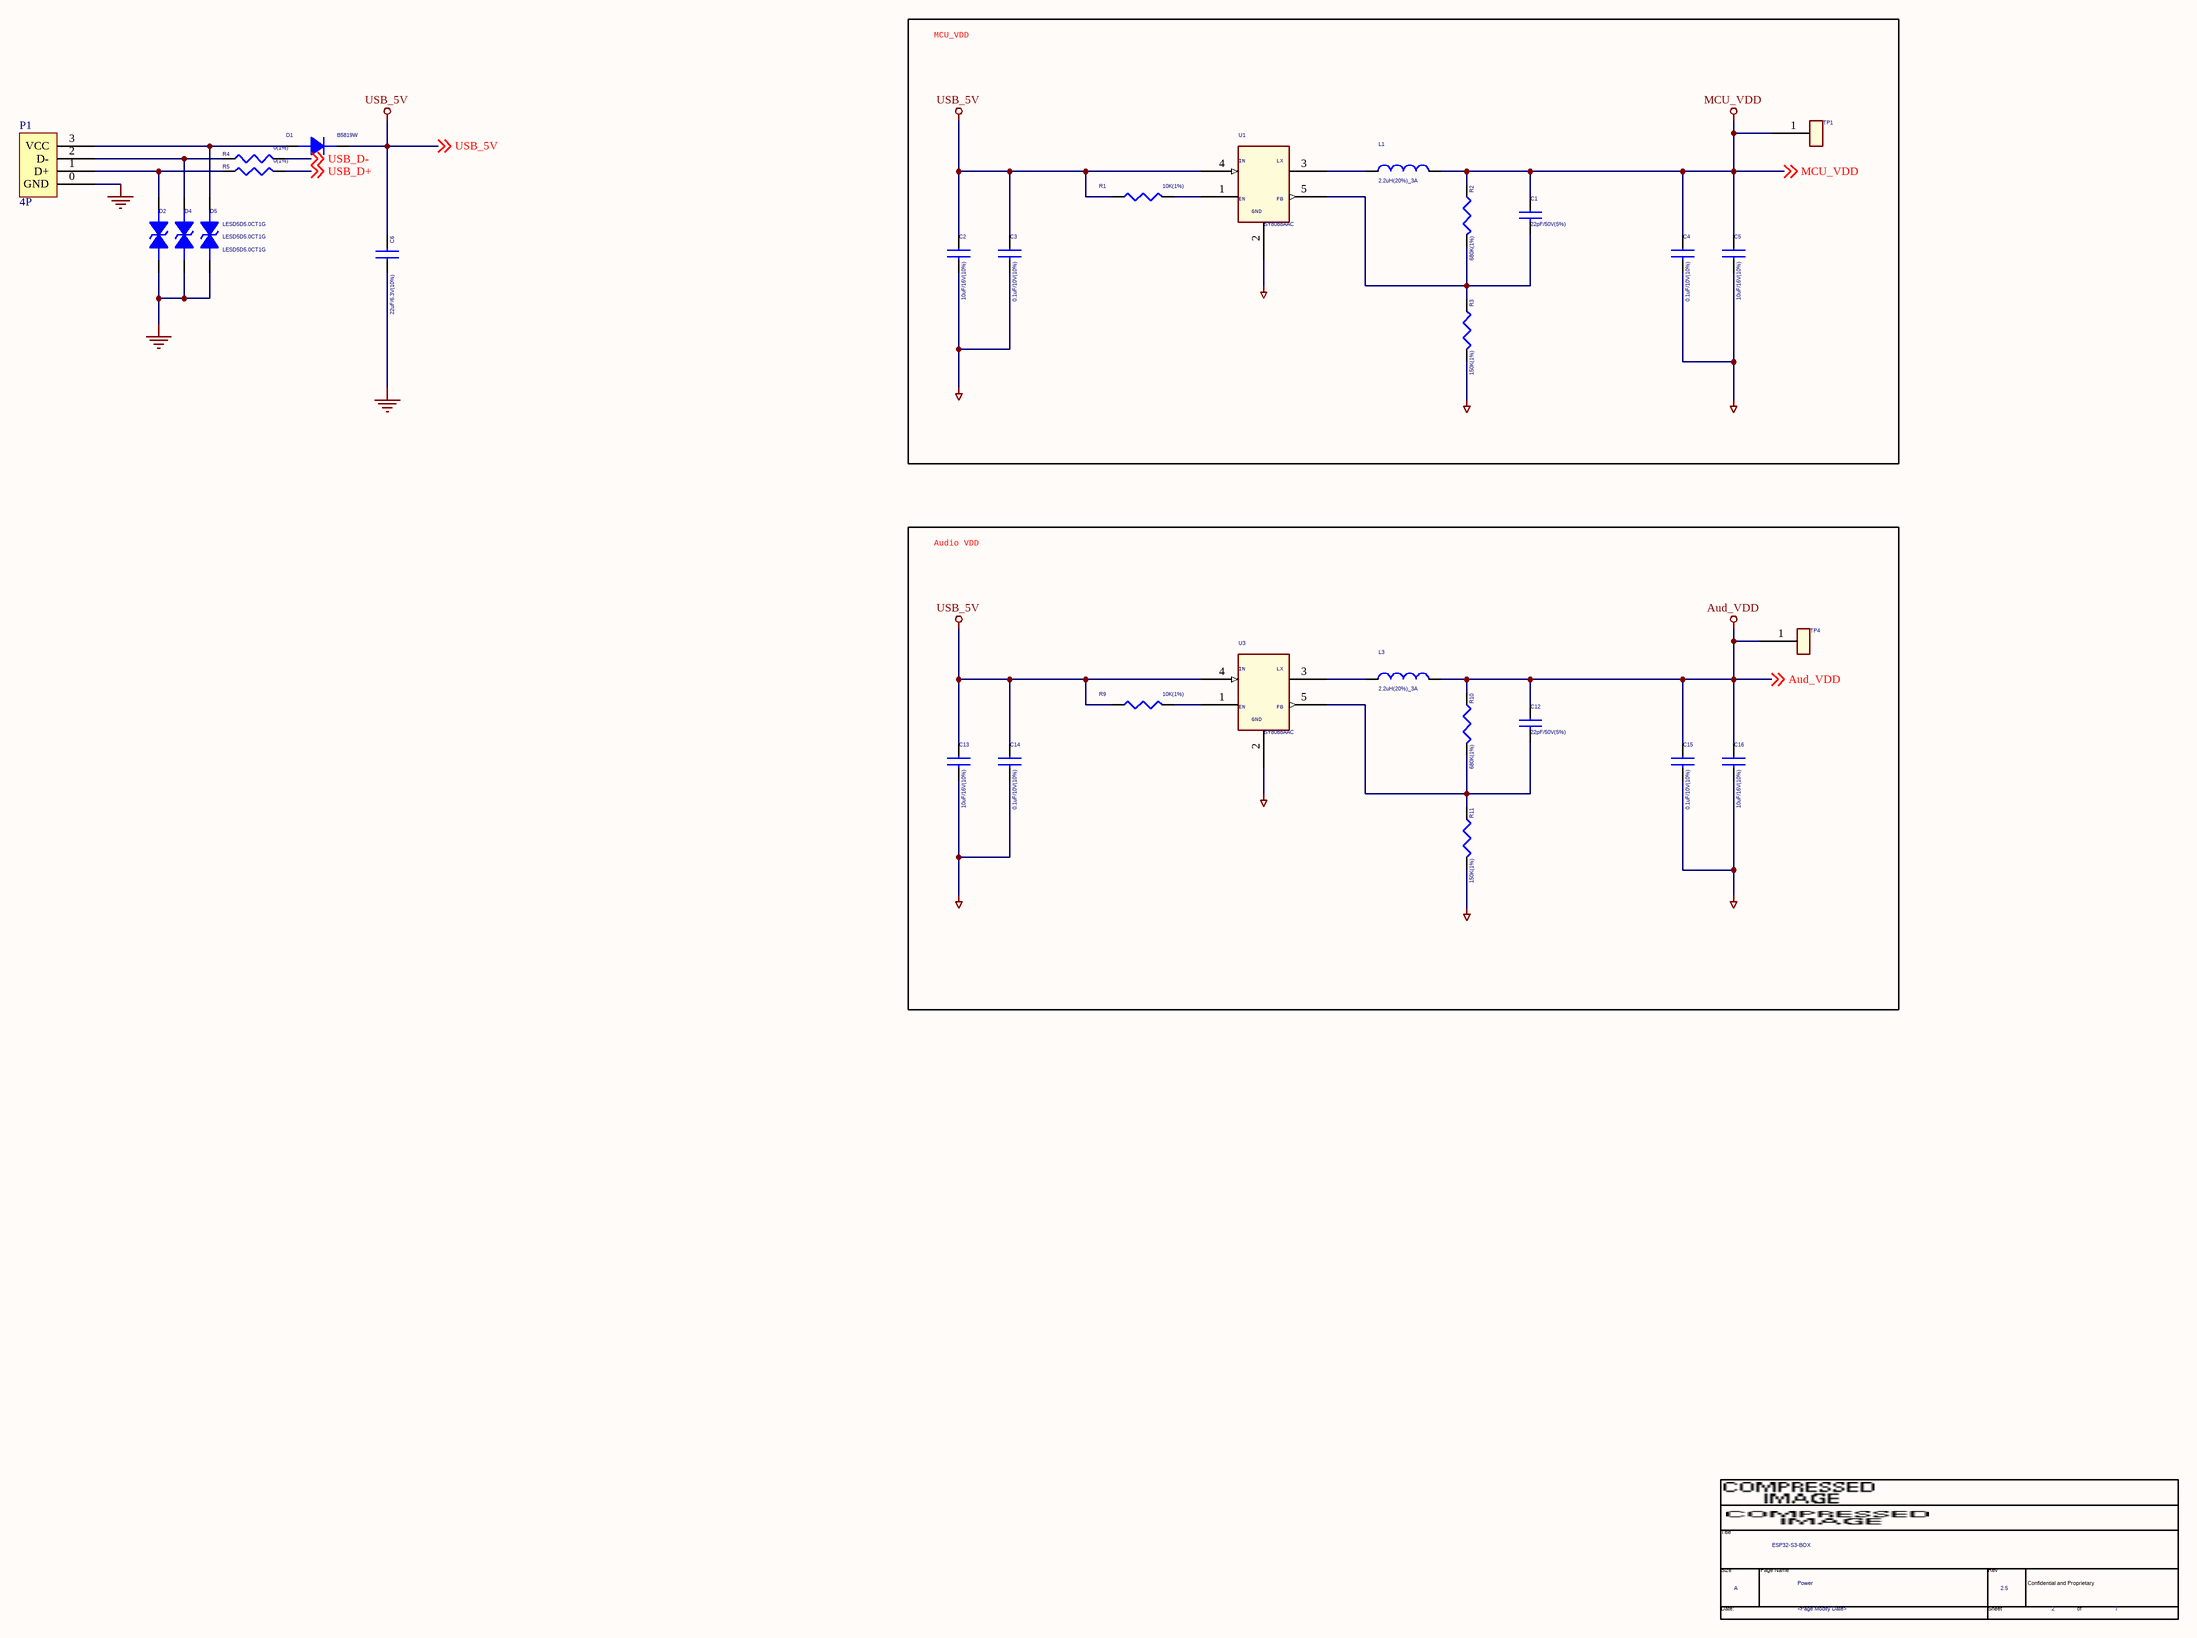
[diagram p7: 01_Power.SchDoc]

### Parts
(Parts that share a designator on the sheet are numbered #1, #2 ... from top to bottom, then left to right.)
*#5  Page Modify Date: <Page Modify Date>  Page Name: Power  Title: ESP32-S3-BOX  Page Size: A  Page Number: 2  Page Count: 7  RevCode: 2.5  (hidden comment: espTitleBlock3)  (graphical)
C1  22pF/50V(5%)  [0402_C]
C2  10uF/16V(10%)  [0603_C]
C3  0.1uF/10V(10%)  [0402_C]
C4  0.1uF/10V(10%)  [0402_C]
C5  10uF/16V(10%)  [0603_C]
C6  22uF/6.3V(10%)  [0603_C]
C12  22pF/50V(5%)  [0402_C]
C13  10uF/16V(10%)  [0603_C]
C14  0.1uF/10V(10%)  [0402_C]
C15  0.1uF/10V(10%)  [0402_C]
C16  10uF/16V(10%)  [0603_C]
D1  B5819W  [SOD-123]
D2  LESD5D5.0CT1G  [SOD-523]
D4  LESD5D5.0CT1G  [SOD-523]
D5  LESD5D5.0CT1G  [SOD-523]
L1  2.2uH(20%)_3A  [L4040]
L3  2.2uH(20%)_3A  [L4040]
P1  4P  [4P]
R1  10K(1%)  [0402_R]
R2  680K(1%)  [0402_R]
R3  150K(1%)  [0402_R]
R4  0(1%)  [0201_R]
R5  0(1%)  [0201_R]
R9  10K(1%)  [0402_R]
R10  680K(1%)  [0402_R]
R11  150K(1%)  [0402_R]
TP1  TESTPOINT  [TPC_D40]  (value not drawn)
TP4  TESTPOINT  [TPC_D40]  (value not drawn)
U1  SY8088AAC  [SOT-23-5]
U3  SY8088AAC  [SOT-23-5]

### Blocks framed on the sheet
MCU_VDD: C1-C5 L1 R1-R3 TP1 U1
Audio VDD: C12-C16 L3 R9-R11 TP4 U3

### Nets
Aud_VDD: C12.1 C15.1 C16.1 L3.2 R10.1 TP4.1 ; off-sheet Aud_VDD
GND: C2.2 C3.2 C4.2 C5.2 C6.1 C13.2 C14.2 C15.2 C16.2 D2.1 D4.1 D5.1 P1.0(GND) R3.2 R11.2 U1.2(GND) U3.2(GND)
MCU_VDD: C1.1 C4.1 C5.1 L1.2 R2.1 TP1.1 ; off-sheet MCU_VDD
USB_5V: C2.1 C3.1 C6.2 C13.1 C14.1 D1.2(K) R1.1 R9.1 U1.4(IN) U3.4(IN) ; off-sheet USB_5V
USB_D+: R5.2 ; off-sheet USB_D+  [project net GPIO20]
USB_D-: R4.2 ; off-sheet USB_D-  [project net GPIO19]
NetC1_2: C1.2 R2.2 R3.1 U1.5(FB)
NetC12_2: C12.2 R10.2 R11.1 U3.5(FB)
NetD1_1: D1.1(A) D5.2 P1.3(VCC)
NetD2_2: D2.2 P1.1(D+) R5.1
NetD4_2: D4.2 P1.2(D-) R4.1
NetL1_1: L1.1 U1.3(LX)
NetL3_1: L3.1 U3.3(LX)
NetR1_2: R1.2 U1.1(EN)
NetR9_2: R9.2 U3.1(EN)

### Notes on the sheet
- (in symbol espTitleBlock3) Title; Size; Page Name; Rev; Confidential and Proprietary; Date:; Sheet; of

### Library data of the parts
*#5 = espTitleBlock3: as *#1 on sheet 05_interface
C1 C12 = CAPACITOR: Part Number: ES11041226520001; CODE12: ES11.04.122.6.5.2.00; Part Type: Capacitor
C2 C5 C13 C16 = CAPACITOR: as C17 on sheet 02_Module; Part Type: Capacitor
C3 C4 C14 C15 = CAPACITOR: as C18 on sheet 02_Module; Part Type: Capacitor
C6 = CAPACITOR: Part Number: ES11067222600001; CODE12: ES11.06.722.2.6.0.00; Part Type: Capacitor
D1 = DIODE_S: Part Number: ES31300150000000; CODE12: ES31.30.0020.00.0.0; Part Type: Diode
D2 D4 D5 = DIODE_BI_DIR: Part Number: ES31320020000000; CODE12: ES31.32.0020.00.0.0; Part Type: Diode
L1 L3 = INDUCTOR_Dup1
R1 R9 = RESISTOR: as R13 on sheet 02_Module; Part Type: Resistor
R2 R10 = RESISTOR: Part Number: ES21045680000001; CODE12: ES21.04.5680.0.00.0; Part Type: Resistor
R3 R11 = RESISTOR: as R69 on sheet 04_Codec; Part Type: Resistor
R4 R5 = RESISTOR: as R44 on sheet 04_Codec; Part Type: Resistor
U1 U3 = SY808X: Part Number: ES41140401000000; CODE12: ES41.14.04.01.00.00; Part Type: Power ICs

## Nets that join several sheets
ADC_GND: 04_Codec (19 pins), 03_ADC (32 pins)
Aud_VDD: 04_Codec (R46.1), 03_ADC (5 pins), 01_Power (6 pins)
GND: 06_WS2812 (6 pins), 05_interface (10 pins), 04_Codec (R50.2 R71.2), 03_ADC (C7.2 R21.1 U2.3), 02_Module (7 pins), 01_Power (17 pins)
MCU_VDD: 06_WS2812 (6 pins), 05_interface (5 pins), 02_Module (R12.1 R16.1 R17.1), 01_Power (6 pins)
USB_5V: 04_Codec (R67.2), 01_Power (10 pins)
ADC_MIC3N: 04_Codec (R66.2), 03_ADC (C26.2)
ADC_MIC3P: 04_Codec (R51.2), 03_ADC (C27.2)
GPIO0: 05_interface (D12.2 SW2.3), 02_Module (U4.27)
GPIO1: 03_ADC (R7.2), 02_Module (U4.39)
GPIO2: 04_Codec (C65.1 U9.2), 03_ADC (C28.1 U5.5), 02_Module (U4.38)
GPIO8: 05_interface (U11.8), 04_Codec (R40.1 R44.1), 03_ADC (R20.2), 02_Module (R16.2 U4.12)
GPIO15: 04_Codec (U9.9), 02_Module (U4.8)
GPIO16: 03_ADC (U2.4), 02_Module (U4.9)
GPIO17: 04_Codec (C66.1 U9.6), 03_ADC (C29.1 U5.9), 02_Module (U4.10)
GPIO18: 05_interface (U11.7), 04_Codec (R41.1 R45.1), 03_ADC (R19.2), 02_Module (R17.2 U4.11)
GPIO19: 02_Module (U4.13), 01_Power (R4.2)
GPIO20: 02_Module (U4.14), 01_Power (R5.2)
GPIO38: 06_WS2812 (U18.4), 02_Module (U4.31)
GPIO46: 04_Codec (R68.2 U10.1), 02_Module (U4.16)
GPIO47: 04_Codec (C67.1 U9.8), 03_ADC (C30.1 U5.10), 02_Module (U4.24)
MCU_RST: 05_interface (D11.2 SW1.3), 02_Module (C19.1 R13.2 U4.3)